# EAGLE design AccessPanelV2 (EAGLE 7.6.0)
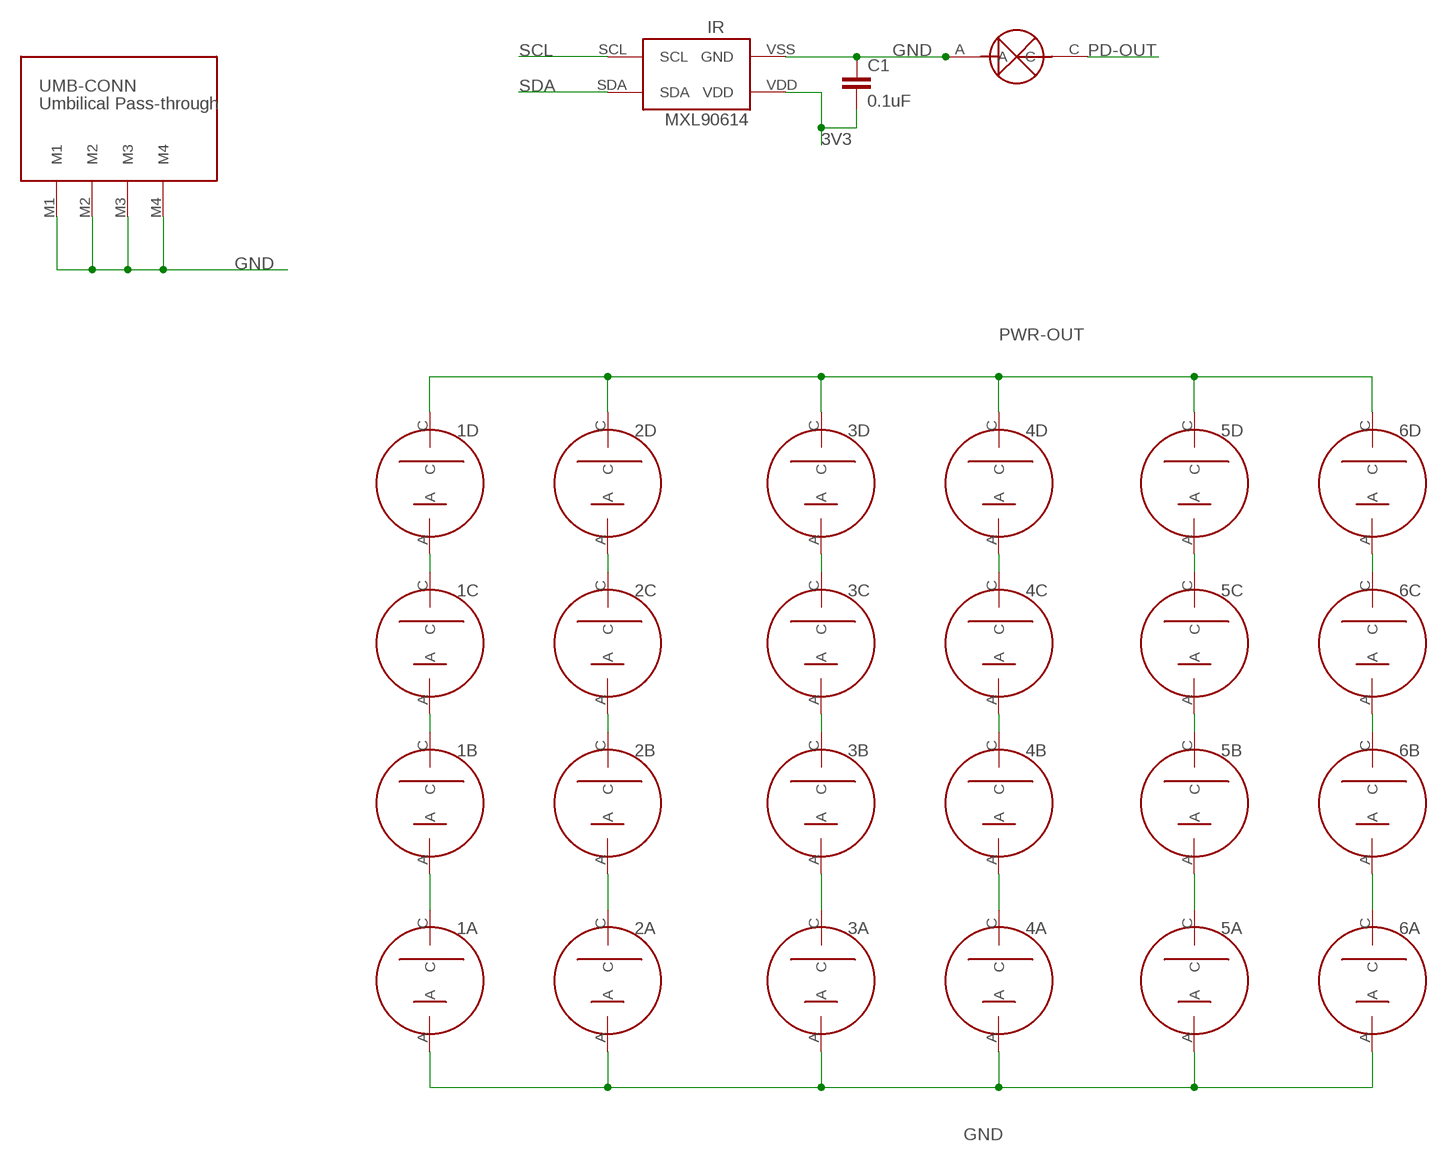
[diagram p0: schematic, sheet 1]

## Parts
1A  NEWSOLARPANEL  [SOLARCELL2]
1B  NEWSOLARPANEL  [SOLARCELL2]
1C  NEWSOLARPANEL  [SOLARCELL2]
1D  NEWSOLARPANEL  [SOLARCELL2]
2A  NEWSOLARPANEL  [SOLARCELL2]
2B  NEWSOLARPANEL  [SOLARCELL2]
2C  NEWSOLARPANEL  [SOLARCELL2]
2D  NEWSOLARPANEL  [SOLARCELL2]
3A  NEWSOLARPANEL  [SOLARCELL2]
3B  NEWSOLARPANEL  [SOLARCELL2]
3C  NEWSOLARPANEL  [SOLARCELL2]
3D  NEWSOLARPANEL  [SOLARCELL2]
4A  NEWSOLARPANEL  [SOLARCELL2]
4B  NEWSOLARPANEL  [SOLARCELL2]
4C  NEWSOLARPANEL  [SOLARCELL2]
4D  NEWSOLARPANEL  [SOLARCELL2]
5A  NEWSOLARPANEL  [SOLARCELL2]
5B  NEWSOLARPANEL  [SOLARCELL2]
5C  NEWSOLARPANEL  [SOLARCELL2]
5D  NEWSOLARPANEL  [SOLARCELL2]
6A  NEWSOLARPANEL  [SOLARCELL2]
6B  NEWSOLARPANEL  [SOLARCELL2]
6C  NEWSOLARPANEL  [SOLARCELL2]
6D  NEWSOLARPANEL  [SOLARCELL2]
C1  0.1uF  CAP0805  [0805]
IR  MXL90620  [MXL90614]
PD  PHOTODETECTOR  [PHOTODECTORDEVICE2]
UMB-CONN  811-004-002-XX-7-22  [811-004-002-XX-7-22]

## Nets
2C: 2B.C 2C.A
3V3: C1.2 IR.VDD
GND: 1A.A 2A.A 3A.A 4A.A 5A.A 6A.A C1.1 IR.VSS(GND) PD.A UMB-CONN.M1 UMB-CONN.M2 UMB-CONN.M3 UMB-CONN.M4
N$1: 1C.C 1D.A
N$2: 2C.C 2D.A
N$3: 3C.C 3D.A
N$4: 4C.C 4D.A
N$5: 5C.C 5D.A
N$6: 6C.C 6D.A
N$7: 6B.C 6C.A
N$8: 6A.C 6B.A
N$9: 5B.C 5C.A
N$10: 5A.C 5B.A
N$11: 4A.C 4B.A
N$12: 4B.C 4C.A
N$13: 3B.C 3C.A
N$15: 1B.C 1C.A
N$16: 1A.C 1B.A
N$17: 2A.C 2B.A
N$18: 3A.C 3B.A
PD-OUT: PD.C
PWR-OUT: 1D.C 2D.C 3D.C 4D.C 5D.C 6D.C
SCL: IR.SCL
SDA: IR.SDA

## Library data of the parts
1A 1B 1C 1D 2A 2B 2C 2D 3A 3B 3C 3D 4A 4B 4C 4D 5A 5B 5C 5D 6A 6B 6C 6D = Solar Panel Parts:NEWSOLARPANEL
C1 = CNTRL_BOARD:CAP: Capacitor Standard 0603 ceramic capacitor, and 0.1" leaded capacitor.
IR = CNTRL_BOARD:MXL90620
PD = Solar Panel Parts:PHOTODETECTOR
UMB-CONN = Solar Panel Parts:811-004-002-XX-7-22

## Board
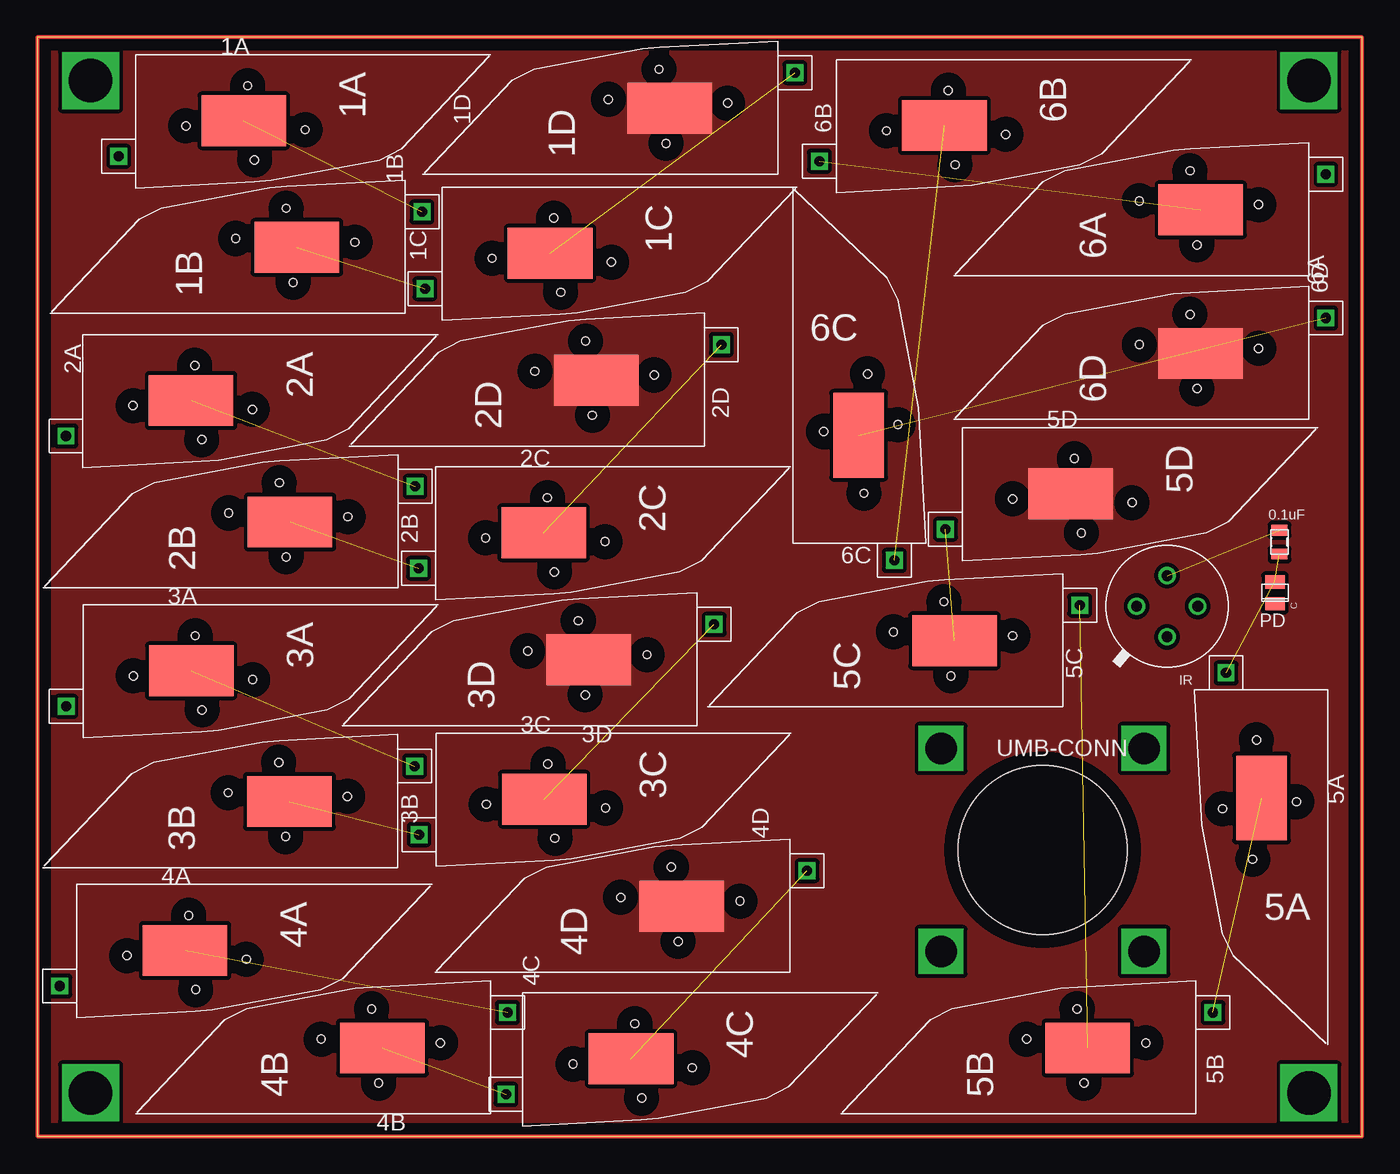
[diagram p1: board, top side]
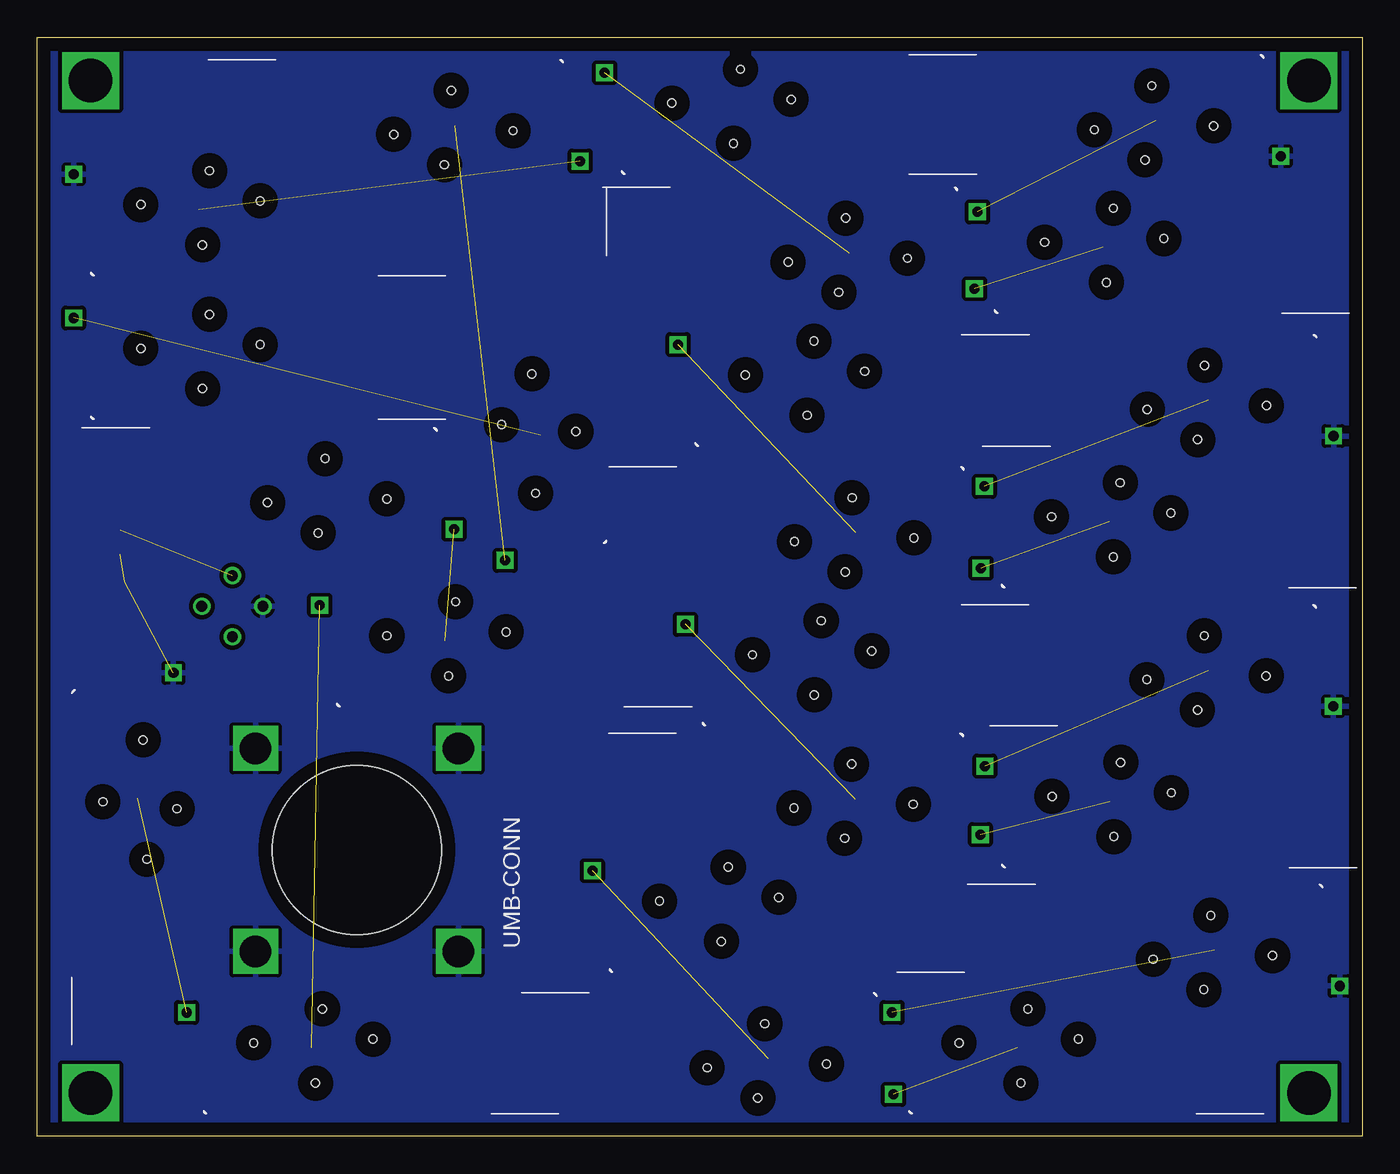
[diagram p2: board, bottom side, seen from below]

Size 99.5 x 82.5 mm. Coordinates in mm from the lower left corner, seen from the top.
Outline: 0,0 99.5,0 99.5,82.5 0,82.5 0,0
Copper layers (1*16): Top 0.035mm / dielectric 1.5mm / Bottom 0.035mm
Design rules "default": minimum track width 10mil, minimum drill 24mil, track to track 8mil, track to pad 8mil, pad to pad 8mil, via to via 8mil, smd to smd 8mil, copper to edge 40mil, drill to drill 8mil, minimum pad ring 10mil, minimum via ring 8mil, stop-mask expansion 4mil, vias tented up to drill 0mil, thermal gap 10mil

### Footprints (pad centres in the part's own frame; a part is rotated, then mirrored left to right if it is on the bottom)
SOLARCELL2 = drill 0.76 square: A 7.62,-1.27 | smd 3.81 x 6.35: C 4.953,8.128 | hole 0.6: 2.32,8.41; 5.62,12.73; 7.89,8.93; 5.34,3.77
0805 = smd 0.8 x 1.2: 1 -0.9,0; 2 0.9,0
MXL90614 = drill 0.8: SCL 2.293,0; VDD -2.293,0; VSS 0,-2.294 | drill 0.8 pad 1.2: SDA 0,2.294
PHOTODECTORDEVICE2 = smd 1 x 1.45: A 0.76,0.4; C -0.88,0.4
811-004-002-XX-7-22 = drill 2.36 square: M1 -7.62,7.62; M2 7.62,7.62; M3 7.62,-7.62; M4 -7.62,-7.62 | hole 12.7: 0,0

### Placement (x,y rotation side)
1A  7.38,81.19 270 top
1B  27.62,61.78 90 top
1C  30.38,71.25 270 top
1D  55.62,72.22 90 top
2A  3.42,60.19 270 top
2B  27.1,41.17 90 top
2C  29.9,50.26 270 top
2D  50.1,51.81 90 top
3A  3.44,39.9 270 top
3B  27.06,20.17 90 top
3C  29.94,30.26 270 top
3D  49.56,30.81 90 top
4A  2.96,18.9 270 top
4B  34.04,1.67 90 top
4C  36.46,10.76 270 top
4D  56.54,12.31 90 top
5A  96.9,33.52 180 top
5B  87.02,1.67 90 top
5C  77.02,32.24 90 top
5D  69.48,53.19 270 top
6A  95.5,64.6 90 top
6B  60,80.83 270 top
6C  56.74,44.5 0 top
6D  95.5,53.81 90 top
C1  93.28,44.6 90 top
IR  84.86,39.79 270 top
PD  93.35,40.85 90 top
UMB-CONN  75.5,21.5 0 top

### Tracks (layer width: path | path; a pad name or v marks a point on that pad's centre or on a via)
2C  (1 unrouted)
3V3  (1 unrouted)
GND  (2 unrouted)
  pour Bottom (isolate 0.305): -5.85,99.18 120.54,99.18 122.04,-6.62 -6.35,-7.62
N$1  (1 unrouted)
N$2  (1 unrouted)
N$3  (1 unrouted)
N$4  (1 unrouted)
N$5  (1 unrouted)
N$6  (1 unrouted)
N$7  (1 unrouted)
N$8  (1 unrouted)
N$9  (1 unrouted)
N$10  (1 unrouted)
N$11  (1 unrouted)
N$12  (1 unrouted)
N$13  (1 unrouted)
N$14
  Top 0.305: 0,82.5 0,0 99.5,0 99.5,82.5 0,82.5
N$15  (1 unrouted)
N$16  (1 unrouted)
N$17  (1 unrouted)
N$18  (1 unrouted)
N$19  (via drill 3.26)
  other vias: 4,3.25
N$20  (via drill 3.26)
  other vias: 4,79.25
N$21  (via drill 3.26)
  other vias: 95.5,79.25
N$22  (via drill 3.26)
  other vias: 95.5,3.25
PWR-OUT
  pour Top (isolate 0.305, no thermals): -7.62,107.95 132.08,107.95 132.08,-10.16 -7.62,-10.16

### Text on the board
tPlace: NEED TO ADD RBF | SDA | SCL | GND | PD-OUT | PWR-OUT | EquiSat: Side Solar Panel V4 | 3V3
bPlace: EquiSat: Side Solar Panel V4 | September 2016 | Ryan Izant | SDA | SCL | GND | PD-OUT | PWR-OUT | 3V3